# Altium schematic sheet Brainy Modul.SchDoc: Brainy Modul
size 420 x 297 mm; Date: .; ApprovedBy: .; CheckedBy: .; Author: DiWou; CompanyName: DL2DW; DrawnBy: DiWou; Engineer: .; Organization: DL2DW; Address1: .; Address2: .; Address3: .; Address4: .; DocumentNumber: 1; Revision: -; SheetNumber: 1; SheetTotal: 1; DrawnDate: 03.07.2016; EngrDate: .; ChkdDate: .; Title1: Brainy; Title2: 256KByte-EPROM-Bank; Title3: .; Desc1: Version 1.0a; Desc2: .; ApprDate: .; Time: .
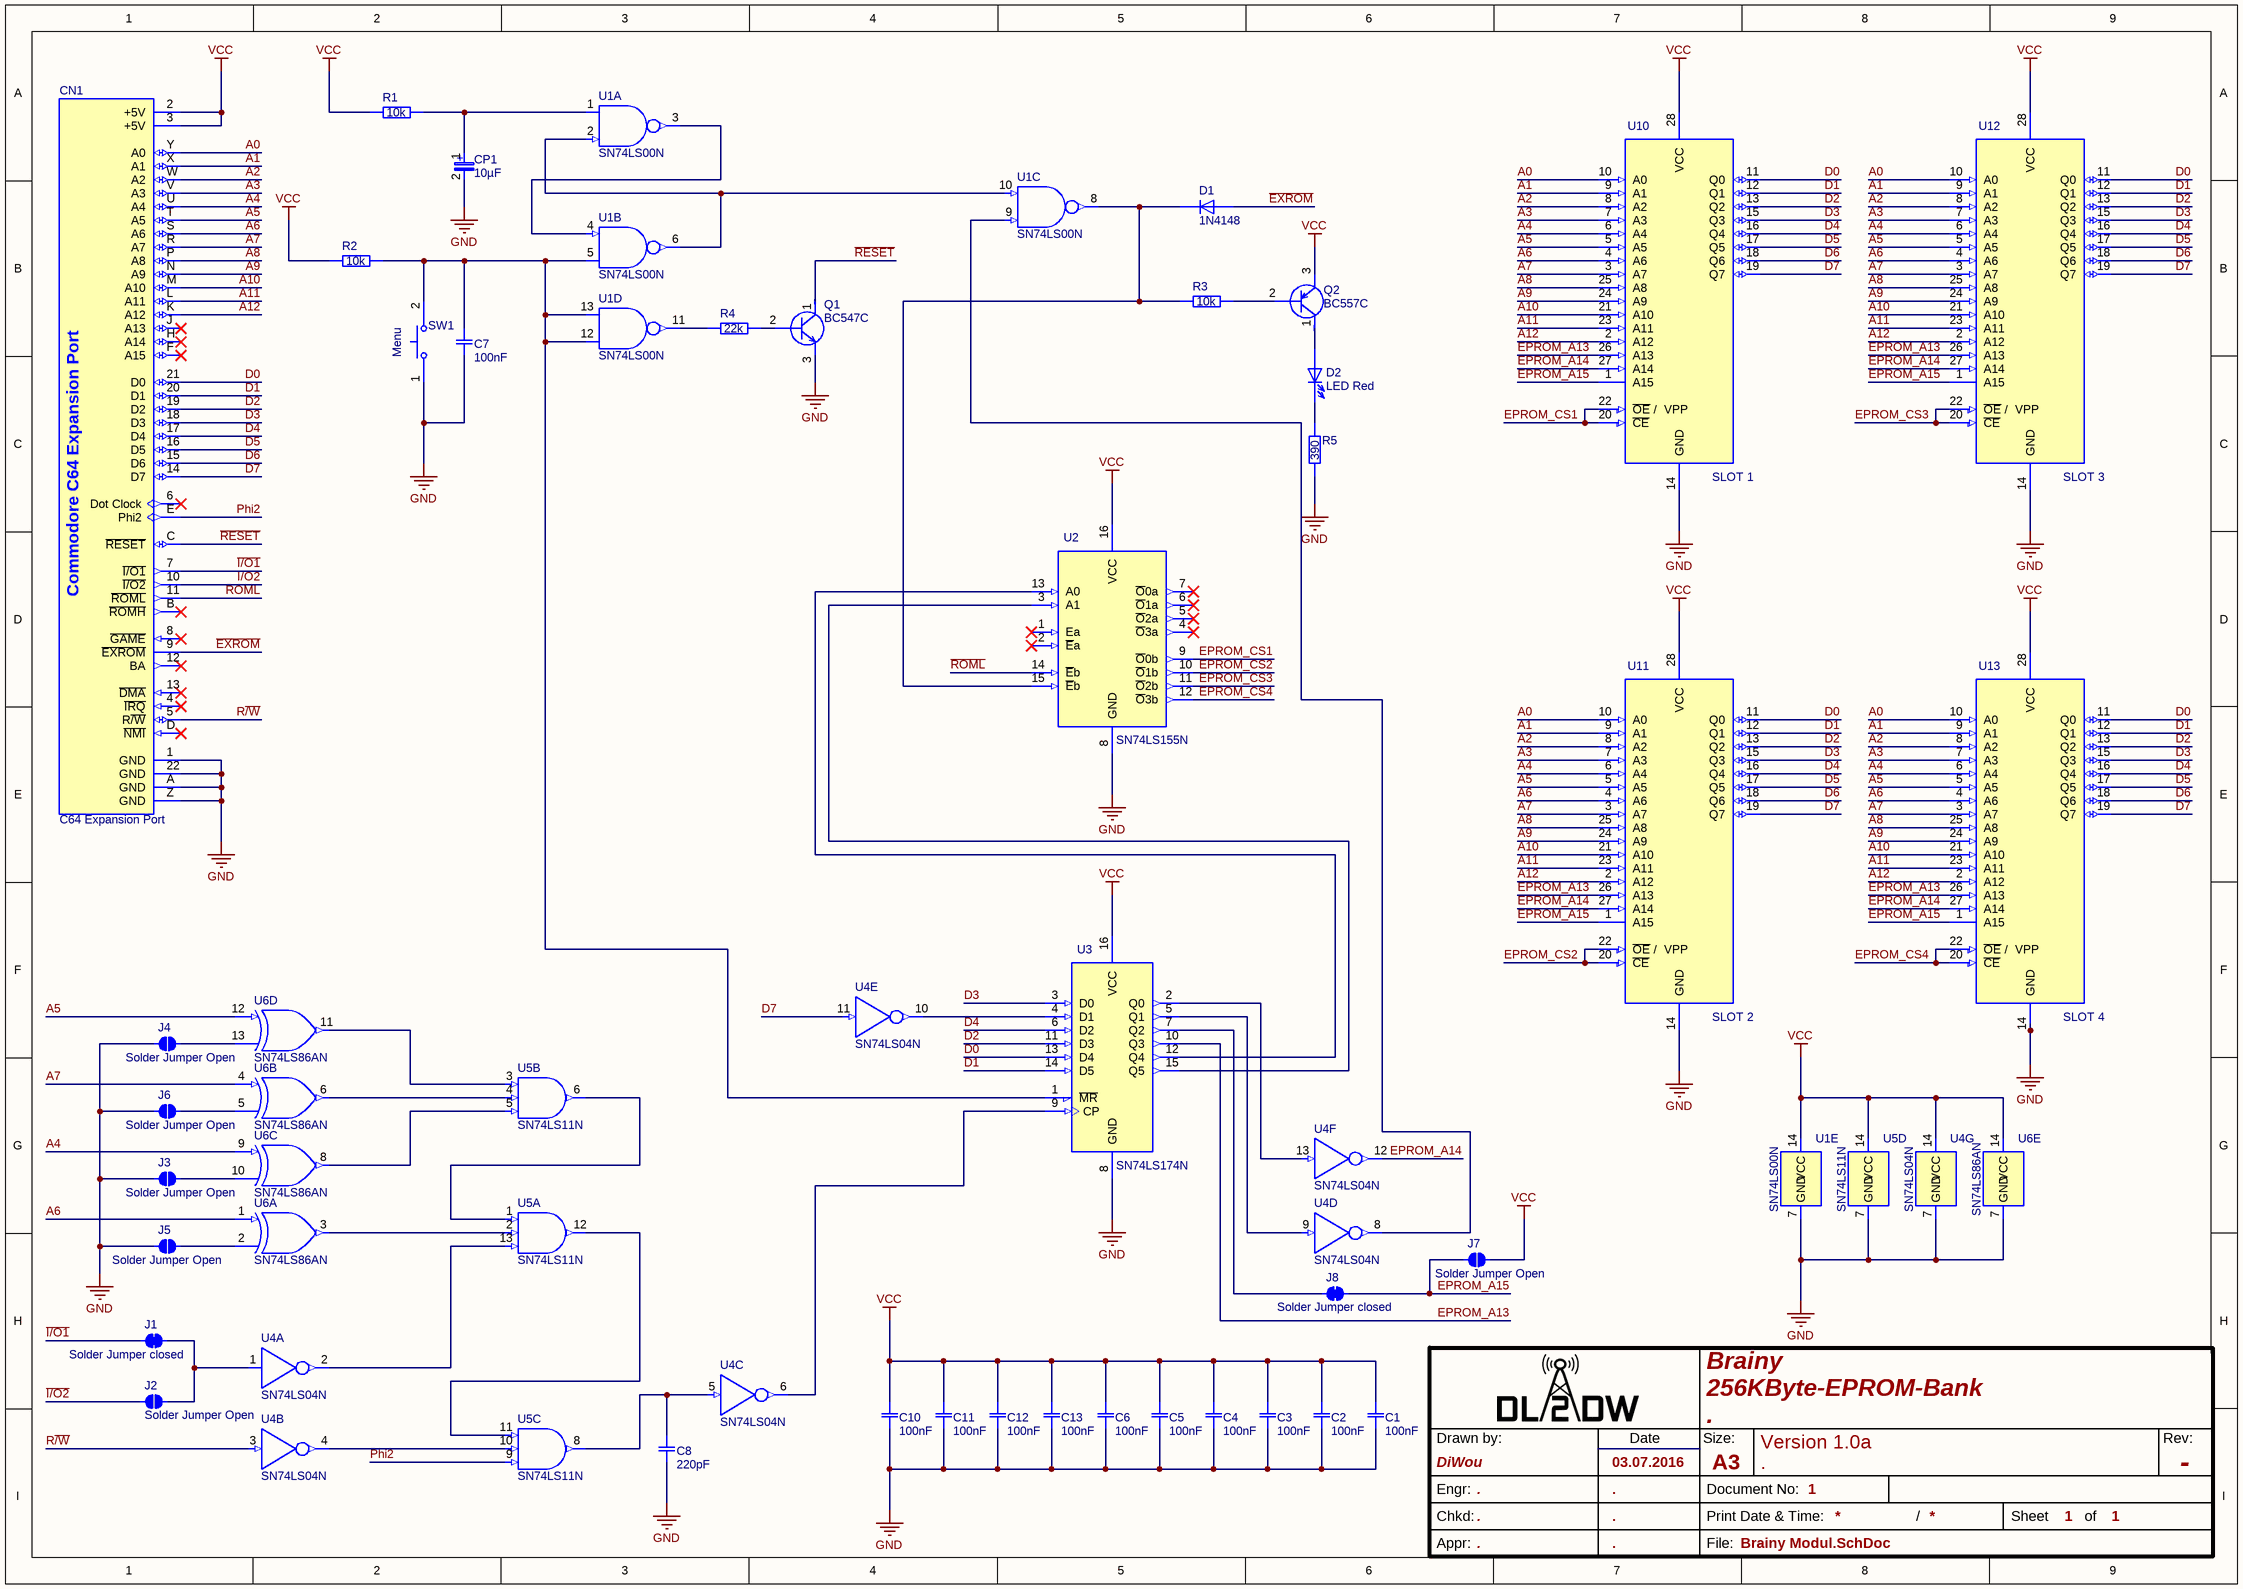
[diagram p0: Brainy Modul.SchDoc]

## Parts
C1  100nF  [CAP Disc 100nF P2.54mm D5.5mm T3mm]
C2  100nF  [CAP Disc 100nF P2.54mm D5.5mm T3mm]
C3  100nF  [CAP Disc 100nF P2.54mm D5.5mm T3mm]
C4  100nF  [CAP Disc 100nF P2.54mm D5.5mm T3mm]
C5  100nF  [CAP Disc 100nF P2.54mm D5.5mm T3mm]
C6  100nF  [CAP Disc 100nF P2.54mm D5.5mm T3mm]
C7  100nF  [CAP Disc 100nF P2.54mm D5.5mm T3mm]
C8  220pF  [KERKO 220P 63V RM2.5mm]
C10  100nF  [CAP Disc 100nF P2.54mm D5.5mm T3mm]
C11  100nF  [CAP Disc 100nF P2.54mm D5.5mm T3mm]
C12  100nF  [CAP Disc 100nF P2.54mm D5.5mm T3mm]
C13  100nF  [CAP Disc 100nF P2.54mm D5.5mm T3mm]
CN1  C64 Expansion Port  [C64 Expansion Port EDGE Connector]  (no BOM)
CP1  10µF  [CAP TAN 10µF T378E106K025AS P5.08mm]
D1  1N4148  [1N4148 P=5.08mm]
D2  LED Red  [LED 3mm Red Straight]
J1  Solder Jumper closed  [Solder Jumper Closed]  (net tie, no BOM)
J2  Solder Jumper Open  [Solder Jumper Open Variant 2]  (no BOM)
J3  Solder Jumper Open  [Solder Jumper Open Variant 2]  (no BOM)
J4  Solder Jumper Open  [Solder Jumper Open Variant 2]  (no BOM)
J5  Solder Jumper Open  [Solder Jumper Open Variant 2]  (no BOM)
J6  Solder Jumper Open  [Solder Jumper Open Variant 2]  (no BOM)
J7  Solder Jumper Open  [Solder Jumper Open Variant 2]  (no BOM)
J8  Solder Jumper closed  [Solder Jumper Closed]  (net tie, no BOM)
Q1  BC547C  [BC547C]
Q2  BC557C  [BC557C]
R1  10k  [10 kOhm R Axial DIN0207 L6.3mm D2.5mm P7.62mm Horizontal]
R2  10k  [10 kOhm R Axial DIN0207 L6.3mm D2.5mm P7.62mm Horizontal]
R3  10k  [10 kOhm R Axial DIN0207 L6.3mm D2.5mm P7.62mm Horizontal]
R4  22k  [22 kOhm R Axial DIN0207 L6.3mm D2.5mm P7.62mm Horizontal]
R5  390  [390 Ohm R Axial DIN0207 L6.3mm D2.5mm P7.62mm Horizontal]
SW1  Menu  [Tactile Switch Push Button Right Angle L=8.35mm]
U1  SN74LS00N  [SN74LS00N with Socket]  (parts A,B,C,D,E of 5)
U2  SN74LS155N  [SN74LS155N with Socket]
U3  SN74LS174N  [SN74LS174N with Socket]
U4  SN74LS04N  [SN74LS04N with Socket]  (parts A,B,C,D,E,F,G of 7)
U5  SN74LS11N  [SN74LS11N with Socket]  (parts A,B,C,D of 4)
U6  SN74LS86AN  [SN74LS86N with Socket]  (parts A,B,C,D,E of 5)
U10  SLOT 1  [Winbond W27C512-45Z DIP-28 with Socket]
U11  SLOT 2  [Winbond W27C512-45Z DIP-28 with Socket]
U12  SLOT 3  [Winbond W27C512-45Z DIP-28 with Socket]
U13  SLOT 4  [Winbond W27C512-45Z DIP-28 with Socket]

## Nets
GND: C1.1 C2.1 C3.1 C4.1 C5.1 C6.1 C7.1 C8.1 C10.1 C11.1 C12.1 C13.1 CN1.1(GND) CN1.22(GND) CN1.A(GND) CN1.Z(GND) CP1.2 J3.1 J4.1 J5.1 J6.1 Q1.3 R5.1 SW1.1 U1.7(GND) U2.8(GND) U3.8(GND) U4.7(GND) U5.7(GND) U6.7(GND) U10.14(GND) U11.14(GND) U12.14(GND) U13.14(GND)
VCC: C1.2 C2.2 C3.2 C4.2 C5.2 C6.2 C10.2 C11.2 C12.2 C13.2 CN1.2(+5V) CN1.3(+5V) J7.2 Q2.3 R1.1 R2.1 U1.14(VCC) U2.16(VCC) U3.16(VCC) U4.14(VCC) U5.14(VCC) U6.14(VCC) U10.28(VCC) U11.28(VCC) U12.28(VCC) U13.28(VCC)
~{EXROM}: CN1.9(~{EXROM}) D1.2
~{I/O1}: CN1.7(~{I/O1}) J1.1
~{I/O2}: CN1.10(~{I/O2}) J2.1
~{RESET}: CN1.C(~{RESET}) Q1.1
~{ROML}: CN1.11(~{ROML}) U2.14(~{E}b)
A0: CN1.Y(A0) U10.10(A0) U11.10(A0) U12.10(A0) U13.10(A0)
A1: CN1.X(A1) U10.9(A1) U11.9(A1) U12.9(A1) U13.9(A1)
A2: CN1.W(A2) U10.8(A2) U11.8(A2) U12.8(A2) U13.8(A2)
A3: CN1.V(A3) U10.7(A3) U11.7(A3) U12.7(A3) U13.7(A3)
A4: CN1.U(A4) U6.9(3A) U10.6(A4) U11.6(A4) U12.6(A4) U13.6(A4)
A5: CN1.T(A5) U6.12(4A) U10.5(A5) U11.5(A5) U12.5(A5) U13.5(A5)
A6: CN1.S(A6) U6.1(1A) U10.4(A6) U11.4(A6) U12.4(A6) U13.4(A6)
A7: CN1.R(A7) U6.4(2A) U10.3(A7) U11.3(A7) U12.3(A7) U13.3(A7)
A8: CN1.P(A8) U10.25(A8) U11.25(A8) U12.25(A8) U13.25(A8)
A9: CN1.N(A9) U10.24(A9) U11.24(A9) U12.24(A9) U13.24(A9)
A10: CN1.M(A10) U10.21(A10) U11.21(A10) U12.21(A10) U13.21(A10)
A11: CN1.L(A11) U10.23(A11) U11.23(A11) U12.23(A11) U13.23(A11)
A12: CN1.K(A12) U10.2(A12) U11.2(A12) U12.2(A12) U13.2(A12)
D0: CN1.21(D0) U3.13(D4) U10.11(Q0) U11.11(Q0) U12.11(Q0) U13.11(Q0)
D1: CN1.20(D1) U3.14(D5) U10.12(Q1) U11.12(Q1) U12.12(Q1) U13.12(Q1)
D2: CN1.19(D2) U3.11(D3) U10.13(Q2) U11.13(Q2) U12.13(Q2) U13.13(Q2)
D3: CN1.18(D3) U3.3(D0) U10.15(Q3) U11.15(Q3) U12.15(Q3) U13.15(Q3)
D4: CN1.17(D4) U3.6(D2) U10.16(Q4) U11.16(Q4) U12.16(Q4) U13.16(Q4)
D5: CN1.16(D5) U10.17(Q5) U11.17(Q5) U12.17(Q5) U13.17(Q5)
D6: CN1.15(D6) U10.18(Q6) U11.18(Q6) U12.18(Q6) U13.18(Q6)
D7: CN1.14(D7) U4.11(5A) U10.19(Q7) U11.19(Q7) U12.19(Q7) U13.19(Q7)
EPROM_A13: U3.10(Q3) U10.26(A13) U11.26(A13) U12.26(A13) U13.26(A13)
EPROM_A14: U4.12(6Y) U10.27(A14) U11.27(A14) U12.27(A14) U13.27(A14)
EPROM_A15: J7.1 J8.2 U10.1(A15) U11.1(A15) U12.1(A15) U13.1(A15)
EPROM_CS1: U2.9(~{O}0b) U10.20(~{CE}) U10.22(~{OE}_/__VPP)
EPROM_CS2: U2.10(~{O}1b) U11.20(~{CE}) U11.22(~{OE}_/__VPP)
EPROM_CS3: U2.11(~{O}2b) U12.20(~{CE}) U12.22(~{OE}_/__VPP)
EPROM_CS4: U2.12(~{O}3b) U13.20(~{CE}) U13.22(~{OE}_/__VPP)
Phi2: CN1.E(Phi2) U5.9(3A)
R~{/W}: CN1.5(R~{/W}) U4.3(2A)
NetC7_2: C7.2 R2.2 SW1.2 U1.5(2B) U1.12(4B) U1.13(4A) U3.1(~{MR})
NetC8_2: C8.2 U4.5(3A) U5.8(3Y)
NetCP1_1: CP1.1 R1.2 U1.1(1A)
NetD1_1: D1.1 R3.1 U1.8(3Y) U2.15(~{E}b)
NetD2_1: D2.1 R5.2
NetD2_2: D2.2 Q2.1
NetJ1_2: J1.2 J2.2 U4.1(1A)
NetJ3_2: J3.2 U6.10(3B)
NetJ4_2: J4.2 U6.13(4B)
NetJ5_2: J5.2 U6.2(2B)
NetJ6_2: J6.2 U6.5(2B)
NetJ8_1: J8.1 U3.7(Q2)
NetQ1_2: Q1.2 R4.2
NetQ2_2: Q2.2 R3.2
NetR4_1: R4.1 U1.11(4Y)
NetU1_2: U1.2(1B) U1.6(2Y) U1.10(3A)
NetU1_3: U1.3(1Y) U1.4(2A)
NetU1_9: U1.9(3B) U4.8(4Y)
NetU2_3: U2.3(A1) U3.15(Q5)
NetU2_13: U2.13(A0) U3.12(Q4)
NetU3_2: U3.2(Q0) U4.13(6A)
NetU3_4: U3.4(D1) U4.10(5Y)
NetU3_5: U3.5(Q1) U4.9(4A)
NetU3_9: U3.9(CP) U4.6(3Y)
NetU4_2: U4.2(1Y) U5.13(1C)
NetU4_4: U4.4(2Y) U5.10(3C)
NetU5_1: U5.1(1A) U5.6(2Y)
NetU5_2: U5.2(1B) U6.3(1Y)
NetU5_3: U5.3(2A) U6.11(4Y)
NetU5_4: U5.4(2B) U6.6(2Y)
NetU5_5: U5.5(2C) U6.8(3Y)
NetU5_11: U5.11(3B) U5.12(1Y)

Not connected (* = marked no-connect by the designer): CN1 4(~{IRQ})* 6(Dot_Clock)* 8(~{GAME})* 12(BA)* 13(~{DMA})* B(~{ROMH})* D(~{NMI})* F(A15)* H(A14)* J(A13)*; SW1 3 4; U2 1(Ea)* 2(~{E}a)* 4(~{O}3a)* 5(~{O}2a)* 6(~{O}1a)* 7(~{O}0a)*

## Notes on the sheet
- Drawn by:
- Date
- Size:
- A3
- Rev:
- Engr:
- Chkd:
- Appr:
- File:
- Document No:
- Print Date & Time:
- /
- Sheet
- of
- (in symbol CMP-Capacitors-Tantalum_Capacitors-00001-5) +
- (in symbol CMP-Commodore-00008-4) Commodore C64 Expansion Port

## Library data of the parts
C1-C7 C10-C13 = CMP-Capacitors-Ceramic_Capacitors-00007-4: Ceramic Disc Capacitors 100nF -20%~+80% 50V Through Hole,P=2.54mm RoHS; ComponentLink1URL: https://lcsc.com/product-detail/Others_Dersonic-CC1H104ZA1PD3F5O3000_C353909.html
C8 = CMP-Capacitors-Ceramic_Capacitors-00015-1: Keramischer Scheibenkondensator, bedrahtet. Für Printmontage, Rastermaß 2,5 mm.; Tolerance: 10%; Voltage Rating (DC): 63V; Lead/Base Style: Straight; Dielectric: C0G; Lead Diameter: 4mm; Mount: Through Hole; Height - Seated (Max): 5mm; Packaging: Tape and Reel; Width: 4mm; Number of Pins: 2; Lead Pitch: 2.5mm; Height: 5; Voltage Rating: 63V; REACH SVHC: No SVHC; Package Quantity: 3500; Capacitance: 220pF; Termination: Radial; Case/Package: Radial; Length: 0.15inch; Thickness: 2.2mm; Min Operating Temperature: -55°C; Max Operating Temperature: 125°C
CN1 = CMP-Commodore-00008-4: Expansion Port EDGE Connector for Interface Cards
CP1 = CMP-Capacitors-Tantalum_Capacitors-00001-5: Tantalum Capacitors - Solid Leaded 25volts 10uF 10%; Dissipation Factor: 6%; Voltage Rating: 25V; Polarity: Polar; ESR (Equivalent Series Resistance): 2.5R; Leakage Current: 3uA; Capacitance: 10uF; Tolerance: 10%; Width: 5.84mm; Termination: Radial; Case/Package: Molded; Voltage Rating (DC): 25V; Length: 7.87mm; Max Operating Temperature: 125°C; Packaging: Bulk; Height: 3.3mm; Lead Pitch: 5.08mm; Depth: 3.3mm; Min Operating Temperature: -55°C
D1 = CMP-Diodes-00002-4: NEXPERIA - 1N4148 - DIODE, 1N4148 AMMO-BOX 10K; Max Forward Surge Current (Ifsm): 4A; Capacitance: 4pF; Voltage: 100V; Forward Current: 200mA; Polarity: Standard; Forward Voltage: 1V; Element Configuration: Single; Max Power Dissipation: 500mW; Reverse Recovery Time: 4ns; Case/Package: SOD; Lead Free: Lead Free; Packaging: Ammo Pack; Termination: Axial; Max Operating Temperature: 200°C; Height: 0.25inch; Min Operating Temperature: -65°C; Weight: 0.01lb; Width: 0.25inch; Current Rating: 200mA; Radiation Hardening: No; Voltage Rating (DC): 100V; Length: 2.5inch; REACH SVHC: No SVHC; Number of Pins: 2; Output Current: 200mA; Max Repetitive Reverse Voltage (Vrrm): 100V; Current: 4A; Peak Non-Repetitive Surge Current: 4A
D2 = CMP-LEDs-00000-4: WURTH ELEKTRONIK   151033RS03000   LED, 3MM,  RED, 2600MCD, 621NM; Viewing Angle: 30°; Test Current: 20mA; Forward Current: 30mA; Lens Style: Clear,Circular,Round; Forward Voltage: 2V; Packaging: Bulk; Height: 5.55mm; Color: Red; Wavelength: 621nm; Max Operating Temperature: 85°C; Luminous Intensity: 2600mcd; Dominant Wavelength: 621nm; REACH SVHC: Unknown; Mount: Through Hole; Lens Size: 3mm; Package Quantity: 1; Case/Package: Radial; Min Operating Temperature: -40°C
J1 J8 = CMP-Mechanicals-00017-7
J2-J7 = CMP-Mechanicals-00016-14
Q1 = CMP-Transistors-00002-1: BC547C Diotec Bipolar NPN Transistor 45V; Collector Base Voltage (VCBO): 50V; Frequency: 300MHz; Power Dissipation: 500mW; Number of Elements: 1; Emitter Base Voltage (VEBO): 5V; Collector Emitter Saturation Voltage: 600mV; Max Operating Temperature: 150°C; Number of Channels: 1; Number of Pins: 3; Polarity: NPN; Collector Emitter Voltage (VCEO): 45V; Mount: Through Hole; Packaging: Tape and Reel; Min Operating Temperature: -55°C; Case/Package: TO-92
Q2 = CMP-Transistors-00003-1: Trans GP BJT PNP 45V 0.1A Automotive 3-Pin TO-92 T/R; Number of Elements: 1; Frequency: 150MHz; Emitter Base Voltage (VEBO): 5V; Power Dissipation: 500mW; Collector Base Voltage (VCBO): 50V; Max Operating Temperature: 150°C; Case/Package: TO-92; Collector Emitter Voltage (VCEO): 45V; Packaging: Tape and Reel; Min Operating Temperature: -55°C; Polarity: PNP; Mount: Through Hole; Number of Pins: 3
R1-R3 = CMP-Resistors-Yageo_THT_DIN_0207-00096-1: RES 10K OHM 1/4W 5% AXIAL; Resistance: 10kR; Temperature Coefficient: 500ppm/°C; Max Power Dissipation: 250mW; Case/Package: Axial; Number of Terminations: 2; Composition: Carbon Film; Packaging: Bulk; Min Operating Temperature: -55°C; Lead Free: Lead Free; Package Quantity: 200; Max Operating Temperature: 155°C; Length: 0.248inch; Tolerance: 5%
R4 = CMP-Resistors-Yageo_THT_DIN_0207-00104-1: RES 22K OHM 1/4W 5% AXIAL; Max Power Dissipation: 250mW; Resistance: 22kR; Temperature Coefficient: 500ppm/°C; Composition: Carbon Film; Tolerance: 5%; Package Quantity: 200; Packaging: Bulk; Max Operating Temperature: 155°C; Min Operating Temperature: -55°C; Case/Package: Axial; Length: 0.248inch; Number of Terminations: 2
R5 = CMP-Resistors-Yageo_THT_DIN_0207-00062-1: RES 390 OHM 1/4W 5% AXIAL; Resistance: 390R; Max Power Dissipation: 250mW; Temperature Coefficient: 500ppm/°C; Composition: Carbon Film; Max Operating Temperature: 155°C; Case/Package: Axial; Length: 0.248inch; Packaging: Bulk; Power Rating: 250mW; Tolerance: 5%; Min Operating Temperature: -55°C; Lead Free: Lead Free; Number of Terminations: 2; Package Quantity: 200
SW1 = CMP-Switches-00004-1: SWITCH TACTILE SPST-NO 0.05A 24V; Contact Current Rating: 50mA; Mechanical Life: 100000Cycles; Illumination Color: Black; Switch Function: Off-Mom; Operating Force: 160gf; Actuator Material: PBT; Actuator Type: Standard; Throw Configuration: SPST; Actuator Length: 0.226inch; Switch Travel: 0.25mm; Illumination Type: Non-Illuminated; Contact Resistance: 100mR; Min Operating Temperature: -35°C; Type: Switch; Height: 7.3mm; Orientation: Straight; Lead Free: Lead Free; Packaging: Loose Piece; Max Voltage Rating (DC): 24V; Contact Material: Copper Alloy; Contact Plating: Silver; Depth: 12.36mm; Package Quantity: 1000; Max Current Rating: 50mA; Width: 6mm; Radiation Hardening: No; Termination: PC Pins; Max Operating Temperature: 85°C; Length: 7.11mm; Electrical Life: 100000Cycles; Mount: Through Hole; ELV: Compliant
U1 = CMP-ICs-74xx-series-00000-3: IC, 74LS, 74LS00, DIP14, 5.25V; Number of Gates: 4; High Level Output Current: -400uA; Number of Input Lines: 2; Number of Output Lines: 1; Low Level Output Current: 8mA; Schmitt Trigger Input: No; Min Supply Voltage: 4.75V; Turn-On Delay Time: 15ns; Output Current: 16mA; Logic Function: NAND; Operating Supply Voltage: 5V; Quiescent Current: 2.4mA; Max Operating Temperature: 70°C; Number of Bits: 4; Packaging: Rail/Tube; Case/Package: PDIP; Lead Free: Lead Free; Length: 19.3mm; Radiation Hardening: No; Package Quantity: 25; Width: 6.35mm; Number of Elements: 4; Mount: Through Hole; Number of Circuits: 4; Min Operating Temperature: 0°C; Contact Plating: Gold; Number of Outputs: 1; Height: 4.57mm; Number of Inputs: 2; Number of Pins: 14; Propagation Delay: 15ns; REACH SVHC: No SVHC; Max Supply Voltage: 5.25V; Weight: 0.032734oz
U2 = CMP-ICs-74xx-series-00058-1: Decoder/Demultiplexer Single/Dual 3/2-to-8/4 16-Pin PDIP; Polarity: Inverting; Max Supply Voltage: 5.25V; Min Supply Voltage: 4.75V; Operating Supply Voltage: 5V; Propagation Delay: 51ns; Low Level Output Current: 8mA; High Level Output Current: -100uA; Number of Pins: 16; Case/Package: PDIP; Max Operating Temperature: 70°C; Min Operating Temperature: 0°C; Mount: Through Hole
U3 = CMP-ICs-74xx-series-00057-1: Flip Flop D-Type Bus Interface Pos-Edge 1-Element 16-Pin PDIP Tube; Number of Elements: 1; Number of Circuits: 7; Number of Output Lines: 2; Polarity: Non-Inverting; Output Current: 8mA; Operating Supply Voltage: 5V; Number of Bits per Element: 6; Output Type: TTL; Frequency: 40MHz; Turn-On Delay Time: 20ns; Clock Edge Trigger Type: Positive Edge; Logic Function: D-Type,Flip-Flop; Min Supply Voltage: 4.75V; Propagation Delay: 30ns; Max Supply Voltage: 5.25V; High Level Output Current: -400uA; Package Quantity: 25; Packaging: Rail/Tube; Length: 19.3mm; Number of Input Lines: 2; Radiation Hardening: No; Case/Package: PDIP; Mount: Through Hole; Max Operating Temperature: 70°C; Number of Bits: 6; Lead Free: Lead Free; Height: 4.57mm; Low Level Output Current: 8mA; Max Frequency: 40MHz; REACH SVHC: No SVHC; Weight: 0.03357oz; Width: 6.35mm; Number of Pins: 16; Min Operating Temperature: 0°C
U4 = CMP-ICs-74xx-series-00006-2: IC HEX INVERTER 14-DIP; Low Level Output Current: 8mA; Number of Output Lines: 6; Propagation Delay: 15ns; High Level Output Current: -400uA; Operating Supply Voltage: 5V; Min Supply Voltage: 4.75V; Logic Function: Buffer,Inverter; Turn-On Delay Time: 22ns; Nominal Supply Current: 100uA; Number of Inputs: 1; Max Supply Voltage: 5.25V; Schmitt Trigger Input: No; Contact Plating: Gold; Packaging: Rail/Tube; Case/Package: PDIP; Lead Free: Lead Free; Weight: 0.032734oz; Width: 6.35mm; Number of Pins: 14; Output Current: 8mA; Number of Gates: 6; Length: 19.3mm; REACH SVHC: No SVHC; Max Output Current: 8mA; Number of Circuits: 6; Min Operating Temperature: 0°C; Number of Bits: 6; Mount: Through Hole; Height: 4.57mm; Package Quantity: 25; Number of Elements: 6; Max Operating Temperature: 70°C; Radiation Hardening: No; Termination: Through Hole
U5 = CMP-ICs-74xx-series-00011-2: IC GATE AND 3CH 3-INP 14DIP; Quiescent Current: 3.3mA; Number of Circuits: 3; Output Current: 8mA; Schmitt Trigger Input: No; Min Supply Voltage: 4.75V; Number of Output Lines: 1; Operating Supply Voltage: 5V; High Level Output Current: -400uA; Propagation Delay: 20ns; Max Supply Voltage: 5.25V; Lead Free: Lead Free; Termination: Through Hole; Max Operating Temperature: 70°C; Number of Pins: 14; Case/Package: PDIP; Logic Function: AND; Number of Elements: 3; Low Level Output Current: 8mA; Number of Inputs: 3; Package Quantity: 25; Length: 19.3mm; Min Operating Temperature: 0°C; Width: 6.35mm; Weight: 0.032734oz; Number of Outputs: 1; Number of Gates: 3; Height: 4.57mm; Number of Bits: 3; Number of Input Lines: 3; Mount: Through Hole; Packaging: Rail/Tube; REACH SVHC: No SVHC; Max Output Current: 8mA; Turn-On Delay Time: 20ns; Radiation Hardening: No
U6 = CMP-ICs-74xx-series-00039-2: IC GATE XOR 4CH 2-INP 14-DIP; Turn-On Delay Time: 30ns; Number of Input Lines: 2; Number of Elements: 4; Quiescent Current: 6.1mA; Min Supply Voltage: 4.75V; Schmitt Trigger Input: No; Logic Function: XOR,OR; Low Level Output Current: 8mA; High Level Output Current: -400uA; Operating Supply Voltage: 5V; Number of Output Lines: 1; Max Supply Voltage: 5.25V; Length: 19.3mm; REACH SVHC: No SVHC; Package Quantity: 25; Number of Gates: 4; Case/Package: PDIP; Mount: Through Hole; Height: 4.57mm; Lead Free: Lead Free; Max Operating Temperature: 70°C; Contact Plating: Gold; Radiation Hardening: No; Width: 6.35mm; Propagation Delay: 30ns; Number of Pins: 14; Number of Bits: 4; Number of Circuits: 4; Number of Inputs: 2; Output Current: 8mA; Packaging: Rail/Tube; Weight: 0.032734oz; Min Operating Temperature: 0°C; Number of Outputs: 1
U10-U13 = CMP-ICs-Memory-00001-2: IC EEPROM 512KBIT 45NS 28DIP; Interface: Parallel; Density: 512Kb; Frequency: 45GHz; Operating Supply Voltage: 5V; Memory Size: 512000B; Case/Package: DIP; Memory Type: EEPROM; Number of Pins: 28; Lead Free: Lead Free; Package Quantity: 15; Packaging: Rail/Tube; Radiation Hardening: No; Access Time: 45ns; Min Operating Temperature: 0°C; Max Operating Temperature: 70°C